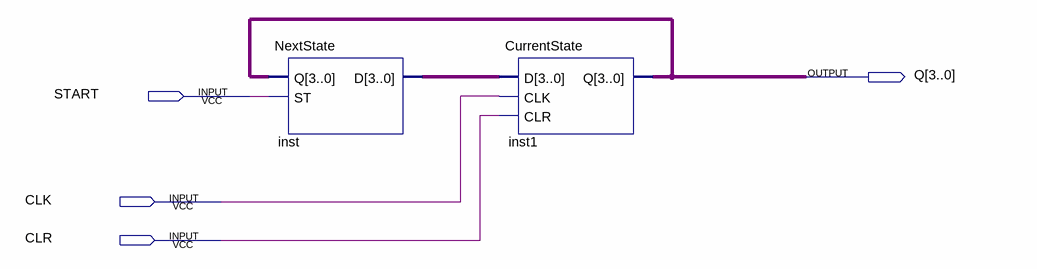
[diagram p0: schematic sheet]
// Quartus schematic FSM.bdf as structural Verilog: 2 symbols, 4 pins
module FSM (
  input  START,
  input  CLK,
  input  CLR,
  output [3:0] Q
);

  wire [3:0] inst_d;

  NextState inst (.Q(Q), .ST(START), .D(inst_d));
  CurrentState inst1 (.D(inst_d), .CLK(CLK), .CLR(CLR), .Q(Q));
endmodule
